# Altium schematic sheet WIFI_MODULE.SchDoc
size A4; SheetNumber: 15; SheetTotal: 26
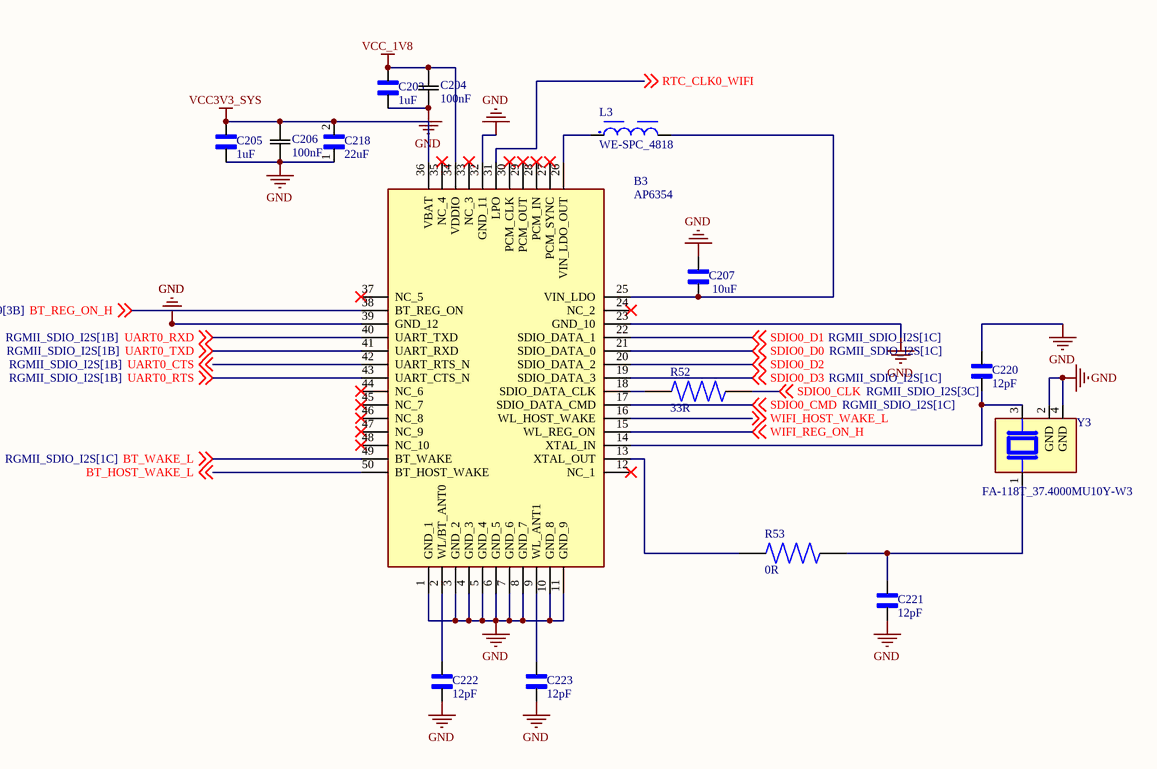
[diagram p0: WIFI_MODULE.SchDoc]

## Parts
B3  AP6354  [AP6354]
C203  1uF  [CAPC1005X56N]
C204  100nF  [CAP_1005_TDK]
C205  1uF  [CAPC1005X56N]
C206  100nF  [CAP_1005_TDK]
C207  10uF  [CAPC1005X70N]
C218  22uF  [CAPC6050X550N]
C220  12pF  [CAPC1608X90]
C221  12pF  [CAPC1608X90]
C222  12pF  [CAPC1608X90]
C223  12pF  [CAPC1608X90]
L3  WE-SPC_4818  [WE-SPC_4818]
R52  33R  [RES_ERA6AHD330V]
R53  0R  [RES_ERJH6G0R00V]
Y3  FA-118T_37.4000MU10Y-W3  [XTAL_FA-118T_37.4000MU10Y-W3]

## Nets
GND: B3.1(GND_1) B3.3(GND_2) B3.4(GND_3) B3.5(GND_4) B3.6(GND_5) B3.7(GND_6) B3.8(GND_7) B3.10(GND_8) B3.11(GND_9) B3.23(GND_10) B3.32(GND_11) B3.39(GND_12) C203.1 C204.1 C205.1 C206.1 C207.2 C218.1 C220.2 C221.1 C222.2 C223.2 Y3.2(GND) Y3.4(GND)
VCC3V3_SYS: B3.36(VBAT) C205.2 C206.2 C218.2
VCC_1V8: B3.34(VDDIO) C203.2 C204.2
BT_HOST_WAKE_L: B3.50(BT_HOST_WAKE) ; off-sheet BT_HOST_WAKE_L
BT_REG_ON_H: B3.38(BT_REG_ON) ; off-sheet BT_REG_ON_H
BT_WAKE_L: B3.49(BT_WAKE) ; off-sheet BT_WAKE_L
RTC_CLK0_WIFI: B3.31(LPO) ; off-sheet RTC_CLK0_WIFI
SDIO0_CLK: R52.2 ; off-sheet SDIO0_CLK
SDIO0_CMD: B3.17(SDIO_DATA_CMD) ; off-sheet SDIO0_CMD
SDIO0_D0: B3.21(SDIO_DATA_0) ; off-sheet SDIO0_D0
SDIO0_D1: B3.22(SDIO_DATA_1) ; off-sheet SDIO0_D1
SDIO0_D2: B3.20(SDIO_DATA_2) ; off-sheet SDIO0_D2
SDIO0_D3: B3.19(SDIO_DATA_3) ; off-sheet SDIO0_D3
UART0_CTS: B3.42(UART_RTS_N) ; off-sheet UART0_CTS
UART0_RTS: B3.43(UART_CTS_N) ; off-sheet UART0_RTS
UART0_RXD: B3.40(UART_TXD) ; off-sheet UART0_RXD
UART0_TXD: B3.41(UART_RXD) ; off-sheet UART0_TXD
WIFI_HOST_WAKE_L: B3.16(WL_HOST_WAKE) ; off-sheet WIFI_HOST_WAKE_L
WIFI_REG_ON_H: B3.15(WL_REG_ON) ; off-sheet WIFI_REG_ON_H
NetB3_2: B3.2(WL/BT_ANT0) C222.1
NetB3_9: B3.9(WL_ANT1) C223.1
NetB3_13: B3.13(XTAL_OUT) R53.1
NetB3_14: B3.14(XTAL_IN) C220.1 Y3.3
NetB3_18: B3.18(SDIO_DATA_CLK) R52.1
NetB3_25: B3.25(VIN_LDO) C207.1 L3.2
NetB3_26: B3.26(VIN_LDO_OUT) L3.1
NetC221_2: C221.2 R53.2 Y3.1

Not connected (* = marked no-connect by the designer): B3 12(NC_1)* 24(NC_2)* 27(PCM_SYNC)* 28(PCM_IN)* 29(PCM_OUT)* 30(PCM_CLK)* 33(NC_3)* 35(NC_4)* 37(NC_5)* 44(NC_6)* 45(NC_7)* 46(NC_8)* 47(NC_9)* 48(NC_10)*

## Library data of the parts
B3 = AP6354: CON; Manufacturer_Name: AMPAK; Geometry.Height: 1.6mm; Manufacturer_Part_Number: AP6354; Mouser Part Number: *; Mouser Price/Stock: *; Arrow Part Number: *; Arrow Price/Stock: *; Datasheet Link: http://www.boardcon.com/download/AP6354_datasheet.pdf
C203 C205 = 0402ZD105KAT4A: 1 ÂµF Â±10% 10V Ceramic Capacitor X5R 0402 (1005 Metric); MF: AVX; SnapEDA_Link: https://www.snapeda.com/parts/0402ZD105KAT4A/AVX/view-part/?ref=snap; Package: 1005 AVX; Value: *; MP: 0402ZD105KAT4A; Check_prices: https://www.snapeda.com/parts/0402ZD105KAT4A/AVX/view-part/?ref=eda
C204 C206 = C1005X7R1H104M050BB: Description; Manufacturer_Name: TDK; Copyright: Copyright (C) 2025 Ultra Librarian. All rights reserved.; Manufacturer_Part_Number: C1005X7R1H104M050BB
C207 = CL05A106MQ5NUNC: 10 ÂµF Â±20% 6.3V Ceramic Capacitor X5R 0402 (1005 Metric); MF: Samsung; SnapEDA_Link: https://www.snapeda.com/parts/CL05A106MQ5NUNC/Samsung/view-part/?ref=snap; Package: SMD-2 Samsung; Value: *; MP: CL05A106MQ5NUNC; Check_prices: https://www.snapeda.com/parts/CL05A106MQ5NUNC/Samsung/view-part/?ref=eda
C218 = CKG57NX7S1H226M500JJ: 22ÂµF Â±20% 50V Ceramic Capacitor X7S Stacked SMD, 2 J-Lead; MP: CKG57NX7S1H226M500JJ; Package: None; Availability: Unavailable; Price: None; Value: *
C220-C223 = 06035J120FBSTR: 12 pF Thin Film Capacitor 50 V 0603 (1608 Metric); MF: AVX; SnapEDA_Link: https://www.snapeda.com/parts/06035J120FBSTR/AVX/view-part/?ref=snap; Package: 0603-2 AVX; Value: *; MP: 06035J120FBSTR; Check_prices: https://www.snapeda.com/parts/06035J120FBSTR/AVX/view-part/?ref=eda
L3 = WE-SPC_4818: 10 ÂµH Shielded Drum Core, Wirewound Inductor 900 mA 248mOhm Max 1919 (4848 Metric); MF: WÃ¼rth Elektronik; MP: 74408941100; SnapEDA_Link: https://www.snapeda.com/parts/74408941100/W%25C3%25BCrth+Elektronik+Midcom/view-part/?ref=snap; Package: 1919 WÃ¼rth Elektronik; Value: *; Check_prices: https://www.snapeda.com/parts/74408941100/W%25C3%25BCrth+Elektronik+Midcom/view-part/?ref=eda
R52 = ERA6AHD330V: Package: None; MP: ERA6AHD330V; Price: None; Value: *; Availability: Unavailable
R53 = ERJH6G0R00V: MP: ERJH6G0R00V; Value: *; Availability: Unavailable; Price: None; Package: None
Y3 = FA-118T_37.4000MU10Y-W3: Crystals XTL MHZ +/-7PPM+/-10PPM-30 85C 12PF ESR=60 OHM 250TR; MF: EPSON; MP: FA-118T 37.4000MU10Y-W3; Value: *; Price: None; Package: NON STANDARD-4 EPSON; Purchase-URL: https://pricing.snapeda.com/search/part/FA-118T 37.4000MU10Y-W3/?ref=eda; SnapEDA_Link: https://www.snapeda.com/parts/FA-118T%2037.4000MU10Y-W3/EPSON/view-part/?ref=snap; Check_prices: https://www.snapeda.com/parts/FA-118T%2037.4000MU10Y-W3/EPSON/view-part/?ref=eda; Availability: In Stock